# Altium schematic sheet NRF.SchDoc
size A
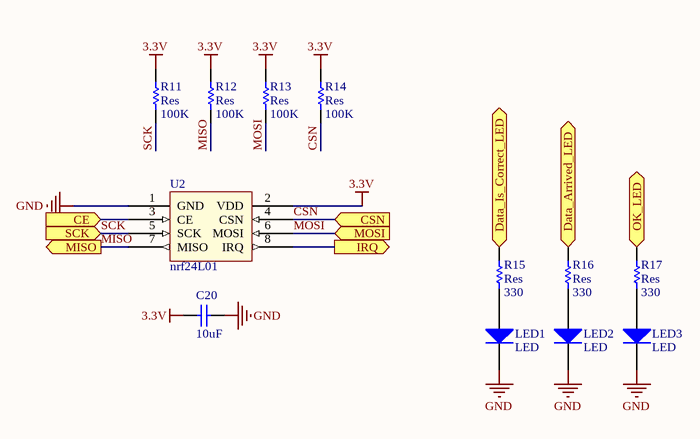
[diagram p0: NRF.SchDoc]

## Parts
C20  value 10uF  [2012[0805]]  (hidden comment: Cap_UP)
LED1  LED  [2012[0805]]
LED2  LED  [2012[0805]]
LED3  LED  [2012[0805]]
R11  Res  value 100K  [2012[0805]]
R12  Res  value 100K  [2012[0805]]
R13  Res  value 100K  [2012[0805]]
R14  Res  value 100K  [2012[0805]]
R15  Res  value 330  [2012[0805]]
R16  Res  value 330  [2012[0805]]
R17  Res  value 330  [2012[0805]]
U2  nrf24L01  [NRF24L01]

## Ports
CE (in), CSN (in), Data_Arrived_LED (in), Data_Is_Correct_LED (in), IRQ (out), MISO (out), MOSI (in), OK_LED (in), SCK (in)

## Nets
3.3V: C20.2 R11.2 R12.2 R13.2 R14.2 U2.2(VDD)
GND: C20.1 LED1.2(K) LED2.2(K) LED3.2(K) U2.1(GND)
CE: U2.3(CE) ; port CE
CSN: R14.1 U2.4(CSN) ; port CSN
Data_Arrived_LED: R16.1 ; port Data_Arrived_LED
Data_Is_Correct_LED: R15.1 ; port Data_Is_Correct_LED
IRQ: U2.8(IRQ) ; port IRQ
MISO: R12.1 U2.7(MISO) ; port MISO
MOSI: R13.1 U2.6(MOSI) ; port MOSI
OK_LED: R17.1 ; port OK_LED
SCK: R11.1 U2.5(SCK) ; port SCK
NetLED1_1: LED1.1(A) R15.2
NetLED2_1: LED2.1(A) R16.2
NetLED3_1: LED3.1(A) R17.2

## Library data of the parts
C20 = Cap_UP: Capacitor; Published: 8-Jun-2000; LatestRevisionDate: 17-Jul-2002; LatestRevisionNote: Re-released for DXP Platform.; PackageReference: RAD-0.3; Publisher: Altium Limited
LED1-LED3 = Diode: 1 Amp General Purpose Rectifier; Revision 1: 11-Jul-2000: SIM Model Added.; Revision 2: 17-Jul-2002: Re-released for DXP Platform.; Package Information: Latest Revision: Aug-1999; Code - JEDEC: DO-204-AL; Published: 8-Jun-2000; Datasheet: Latest Revision: 1998; Package Reference: DO-41; Publisher: Altium Limited
R11-R17 = Res: Semiconductor Resistor; Published: 8-Jun-2000; LatestRevisionDate: 17-Jul-2002; LatestRevisionNote: Re-released for DXP Platform.; PackageReference: AXIAL-0.5; Publisher: Altium Limited